# EAGLE design Sensors_Board_V1 (EAGLE 9.6.2)
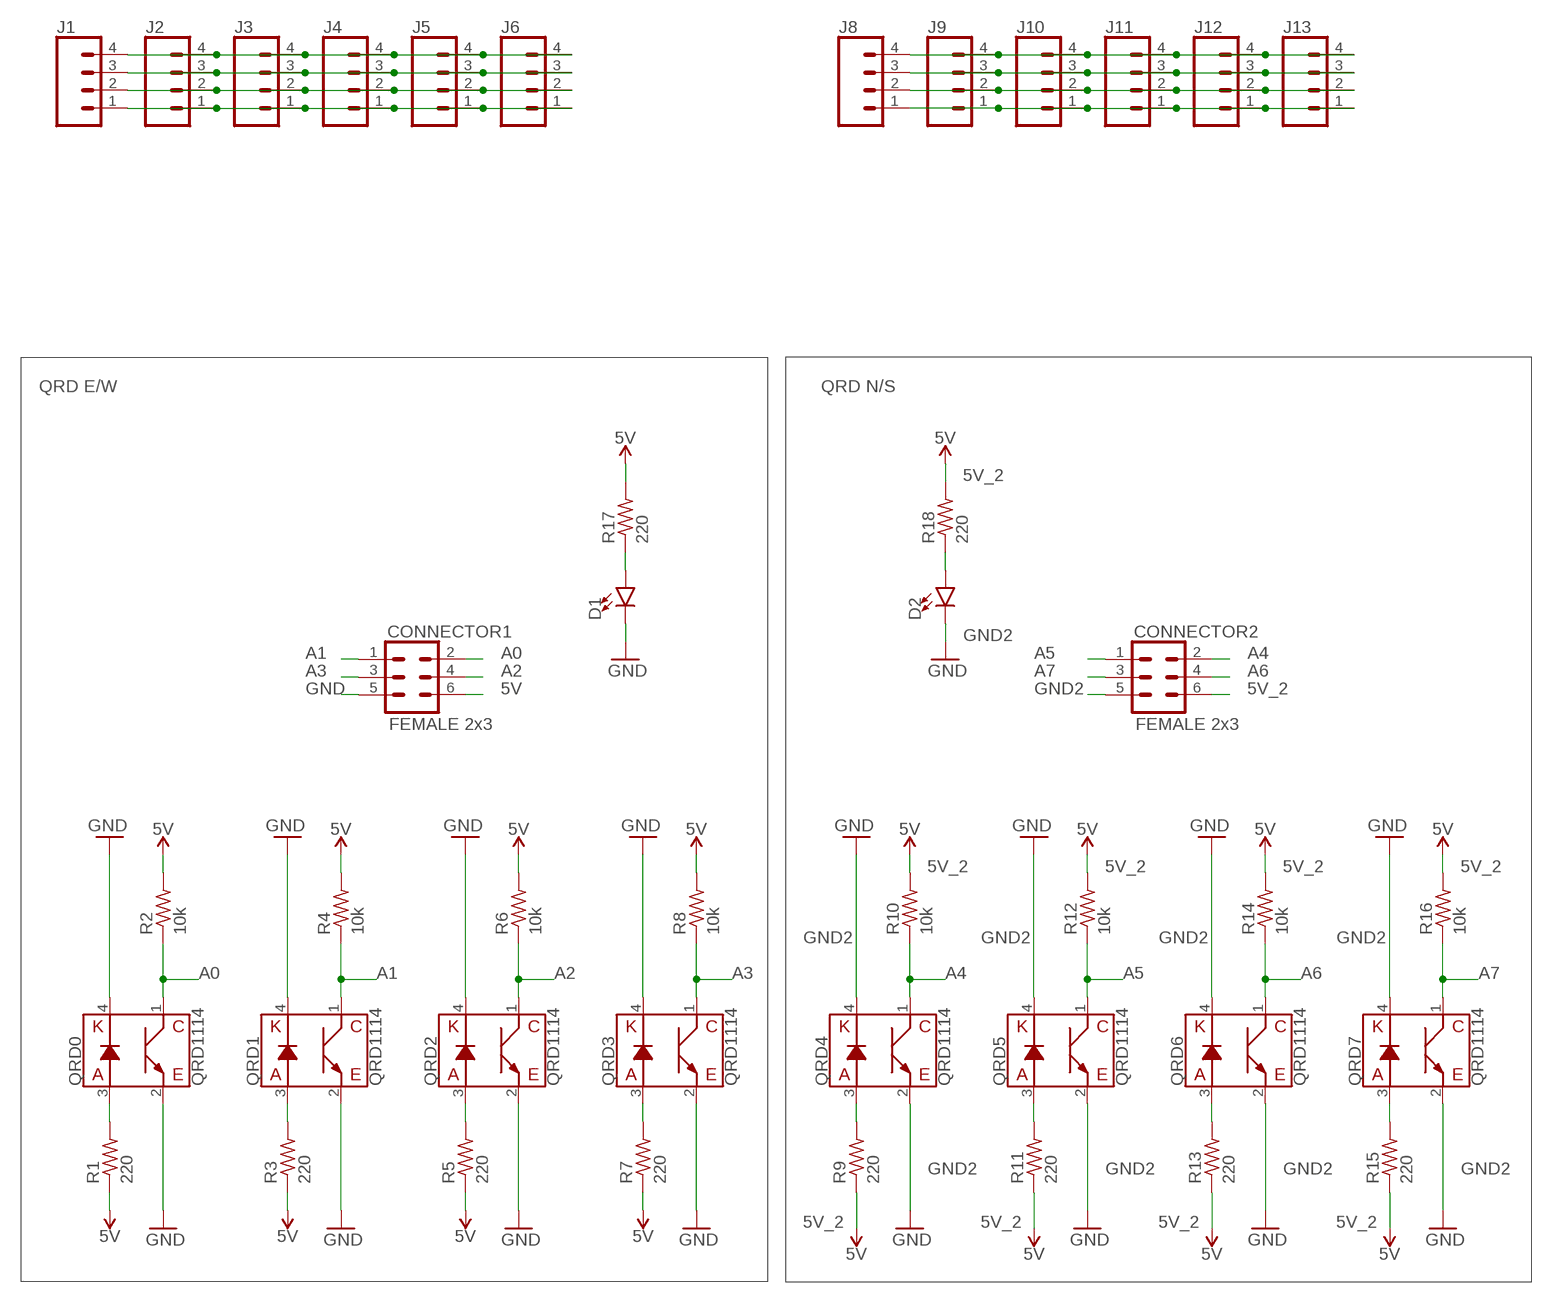
[diagram p0: schematic, sheet 1]

## Parts
CONNECTOR1  FEMALE 2x3  CONN_03X2FEMALE  [2X3]
CONNECTOR2  FEMALE 2x3  CONN_03X2FEMALE  [2X3]
D1  LED3MM  [LED_3MM]
D2  LED3MM  [LED_3MM]
J1  CONN_04  [1X04]
J2  CONN_04  [1X04]
J3  CONN_04  [1X04]
J4  CONN_04  [1X04]
J5  CONN_04  [1X04]
J6  CONN_04  [1X04]
J8  CONN_04  [1X04]
J9  CONN_04  [1X04]
J10  CONN_04  [1X04]
J11  CONN_04  [1X04]
J12  CONN_04  [1X04]
J13  CONN_04  [1X04]
QRD0  QRD1114  [QRD1114]
QRD1  QRD1114  [QRD1114]
QRD2  QRD1114  [QRD1114]
QRD3  QRD1114  [QRD1114]
QRD4  QRD1114  [QRD1114]
QRD5  QRD1114  [QRD1114]
QRD6  QRD1114  [QRD1114]
QRD7  QRD1114  [QRD1114]
R1  220  R-US_0204/7  [0204/7]
R2  10k  R-US_0204/7  [0204/7]
R3  220  R-US_0204/7  [0204/7]
R4  10k  R-US_0204/7  [0204/7]
R5  220  R-US_0204/7  [0204/7]
R6  10k  R-US_0204/7  [0204/7]
R7  220  R-US_0204/7  [0204/7]
R8  10k  R-US_0204/7  [0204/7]
R9  220  R-US_0204/7  [0204/7]
R10  10k  R-US_0204/7  [0204/7]
R11  220  R-US_0204/7  [0204/7]
R12  10k  R-US_0204/7  [0204/7]
R13  220  R-US_0204/7  [0204/7]
R14  10k  R-US_0204/7  [0204/7]
R15  220  R-US_0204/7  [0204/7]
R16  10k  R-US_0204/7  [0204/7]
R17  220  R-US_0204/7  [0204/7]
R18  220  R-US_0204/7  [0204/7]

## Nets
5V: CONNECTOR1.6 R1.1 R2.2 R3.1 R4.2 R5.1 R6.2 R7.1 R8.2 R17.2
5V_2: CONNECTOR2.6 R9.1 R10.2 R11.1 R12.2 R13.1 R14.2 R15.1 R16.2 R18.2 ; supply symbol labelled 5V
A0: CONNECTOR1.2 QRD0.1(C) R2.1
A1: CONNECTOR1.1 QRD1.1(C) R4.1
A2: CONNECTOR1.4 QRD2.1(C) R6.1
A3: CONNECTOR1.3 QRD3.1(C) R8.1
A4: CONNECTOR2.2 QRD4.1(C) R10.1
A5: CONNECTOR2.1 QRD5.1(C) R12.1
A6: CONNECTOR2.4 QRD6.1(C) R14.1
A7: CONNECTOR2.3 QRD7.1(C) R16.1
GND: CONNECTOR1.5 D1.K(C) QRD0.2(E) QRD0.4(K) QRD1.2(E) QRD1.4(K) QRD2.2(E) QRD2.4(K) QRD3.2(E) QRD3.4(K)
GND2: CONNECTOR2.5 D2.K(C) QRD4.2(E) QRD4.4(K) QRD5.2(E) QRD5.4(K) QRD6.2(E) QRD6.4(K) QRD7.2(E) QRD7.4(K) ; supply symbol labelled GND
N$1: QRD0.3(A) R1.2
N$2: QRD1.3(A) R3.2
N$3: QRD2.3(A) R5.2
N$4: QRD3.3(A) R7.2
N$5: QRD4.3(A) R9.2
N$6: QRD5.3(A) R11.2
N$7: QRD6.3(A) R13.2
N$8: QRD7.3(A) R15.2
N$9: D1.A R17.1
N$10: D2.A R18.1
N$11: J1.4 J2.4 J3.4 J4.4 J5.4 J6.4
N$12: J1.3 J2.3 J3.3 J4.3 J5.3 J6.3
N$13: J1.2 J2.2 J3.2 J4.2 J5.2 J6.2
N$14: J1.1 J2.1 J3.1 J4.1 J5.1 J6.1
N$15: J8.4 J9.4 J10.4 J11.4 J12.4 J13.4
N$16: J8.3 J9.3 J10.3 J11.3 J12.3 J13.3
N$17: J8.2 J9.2 J10.2 J11.2 J12.2 J13.2
N$18: J8.1 J9.1 J10.1 J11.1 J12.1 J13.1

## Notes on the sheet
- QRD E/W | QRD N/S

## Library data of the parts
CONNECTOR1 CONNECTOR2 = SparkFun-Connectors:CONN_03X2: Multi connection point. Often used as Generic Header-pin footprint for 0.1 inch spaced/style header connections You can populate with any combo of single row headers, but if you'd like an exact match, check these: Header - 2x3 (Male, 0.1") <https://www.sparkfun.com/products/12807> (PRT-12807) Header - 2x3 (Female, 0.1") <https://www.sparkfun.com/products/13010> (PRT-13010) 2x3 Pin Shrouded Header <https://www.sparkfun.com/products/10877> (PRT-10877) On any of the 0.1 inch spaced packages, you can populate with these: Break Away Headers - Straight <https://www.sparkfun.com/products/116> (PRT-00116) Break Away Male Headers - Right Angle <https://www.sparkfun.com/products/553> (PRT-00553) Female Headers <https://www.sparkfun.com/products/115> (PRT-00115) Break Away Headers - Machine Pin <https://www.sparkfun.com/products/117> (PRT-00117) Break Away Female Headers - Swiss Machine Pin <https://www.sparkfun.com/products/743> (PRT-00743) Special note: the shrouded connector mates well with our 3x2 ribbon cables: Ribbon Crimp Connector - 6-pin (2x3, Female) <https://www.sparkfun.com/products/10651> (PRT-10651) Ribbon Cable - 6 wire (15ft) <https://www.sparkfun.com/products/10646> (PRT-10646); PROD_ID: CONN-11566
D1 D2 = SparkFun-LED:LED: LED (Generic) Standard schematic elements and footprints for 5mm, 3mm, 1206, and 0603 sized LEDs. Generic LEDs with no color specified.; PROD_ID: DIO-08794
J1-J6 J8-J13 = SparkFun-Connectors:CONN_04: Multi connection point. Often used as Generic Header-pin footprint for 0.1 inch spaced/style header connections On any of the 0.1 inch spaced packages, you can populate with these: Break Away Headers - Straight <https://www.sparkfun.com/products/116> (PRT-00116) Break Away Male Headers - Right Angle <https://www.sparkfun.com/products/553> (PRT-00553) Female Headers <https://www.sparkfun.com/products/115> (PRT-00115) Break Away Headers - Machine Pin <https://www.sparkfun.com/products/117> (PRT-00117) Break Away Female Headers - Swiss Machine Pin <https://www.sparkfun.com/products/743> (PRT-00743) For SCREWTERMINALS and SPRING TERMINALS visit here: Screw Terimnals on SparkFun.com <https://www.sparkfun.com/search/results?term=Screw+Terminals> (5mm/3.5mm/2.54mm spacing) This device is also useful as a general connection point to wire up your design to another part of your project. Our various solder wires solder well into these plated through hole pads. Hook-Up Wire - Assortment (Stranded, 22 AWG) <https://www.sparkfun.com/products/11375> (PRT-11375) Hook-Up Wire - Assortment (Solid Core, 22 AWG) <https://www.sparkfun.com/products/11367> (PRT-11367) View the entire wire category on our website here <https://www.sparkfun.com/categories/141> Special notes: Molex polarized connector foot print use with SKU : PRT-08231 with associated crimp pins and housings. 1MM SMD Version SKU: PRT-10208; PROD_ID: CONN-09696
QRD0 QRD1-QRD7 = SparkFun-Sensors:QRD1114: QRD1114 Reflective Proximity, Object Sensor This sensor uses an infrared emitted diode combined with an infrared phototransistor to detect the reflected infrared signal. Ideal for sensing black-to-white transitions or can be used to detect nearby objects (.5-1cm). Datasheet <http://www.sparkfun.com/datasheets/BOT/QRD1114.pdf> SparkFun Products Optical Detector / Phototransistor - QRD1114 <https://www.sparkfun.com/products/246> (SEN-00246); PROD_ID: IC-09032; SF_ID: SEN-00246
R1-R18 = adafruit:R-US_: RESISTOR, American symbol

## Board
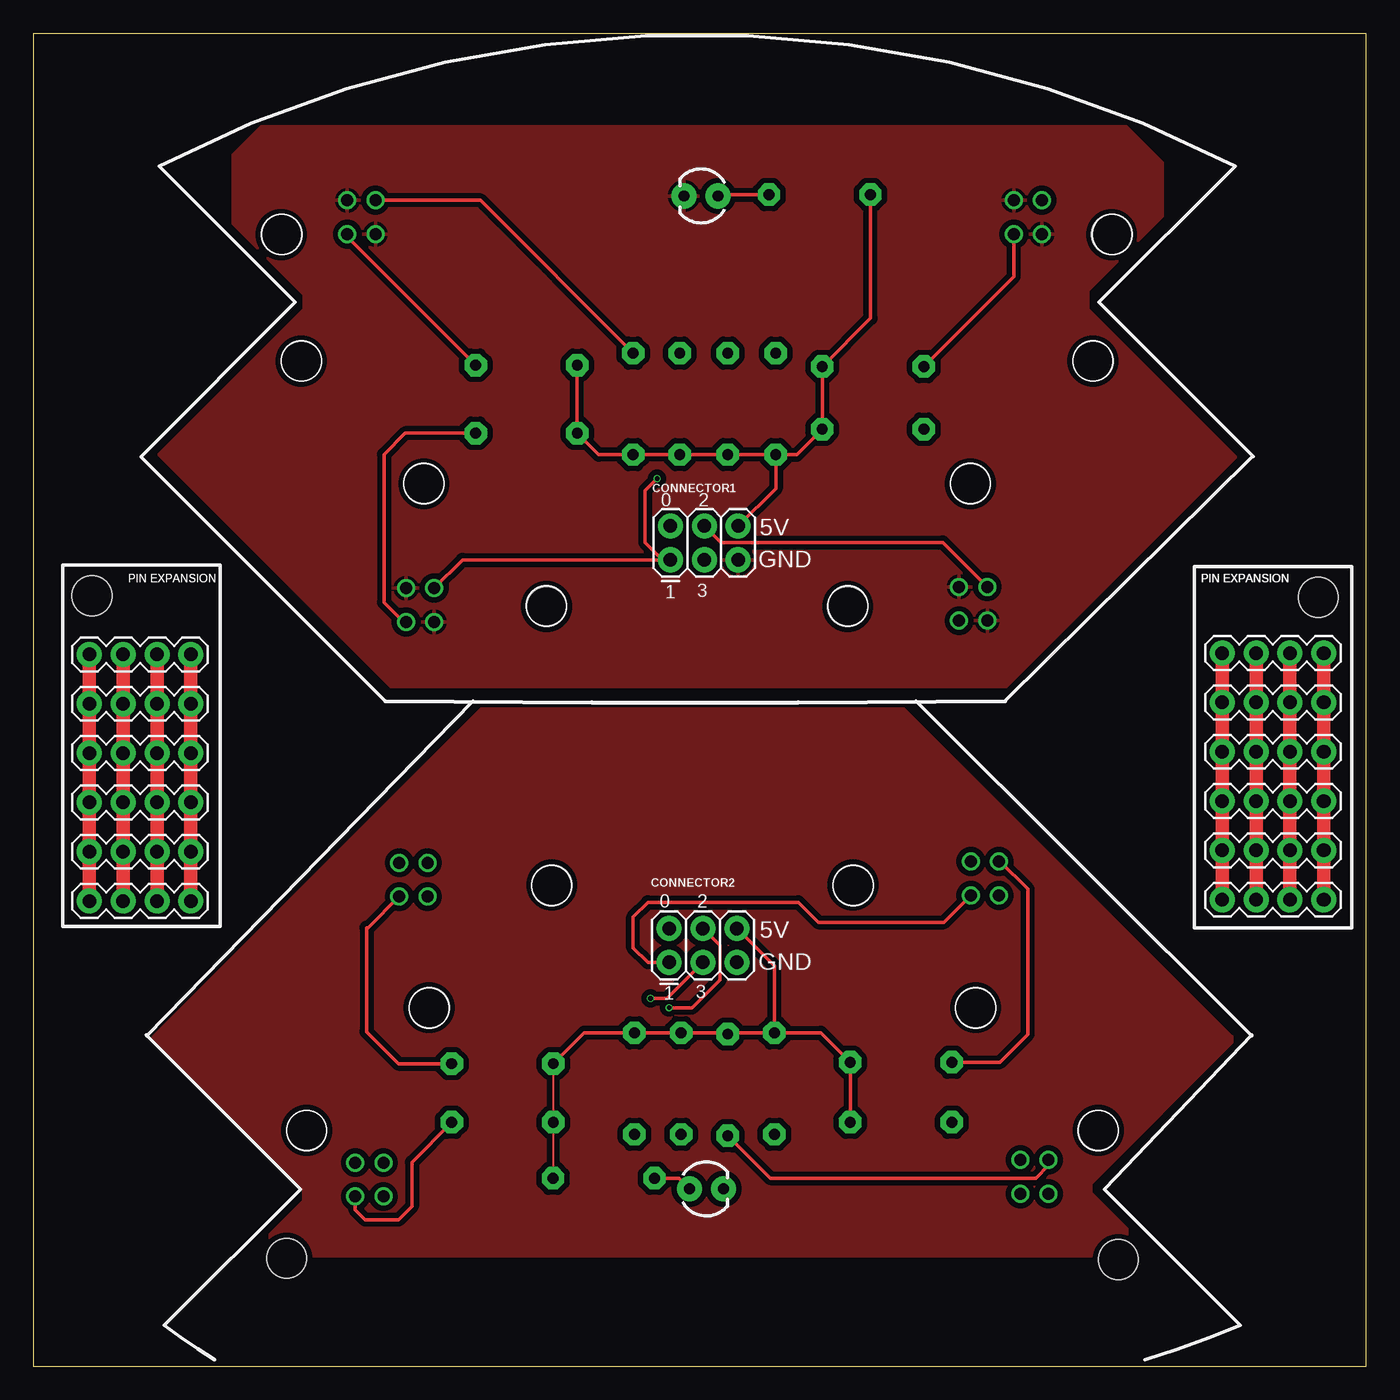
[diagram p1: board, top side]
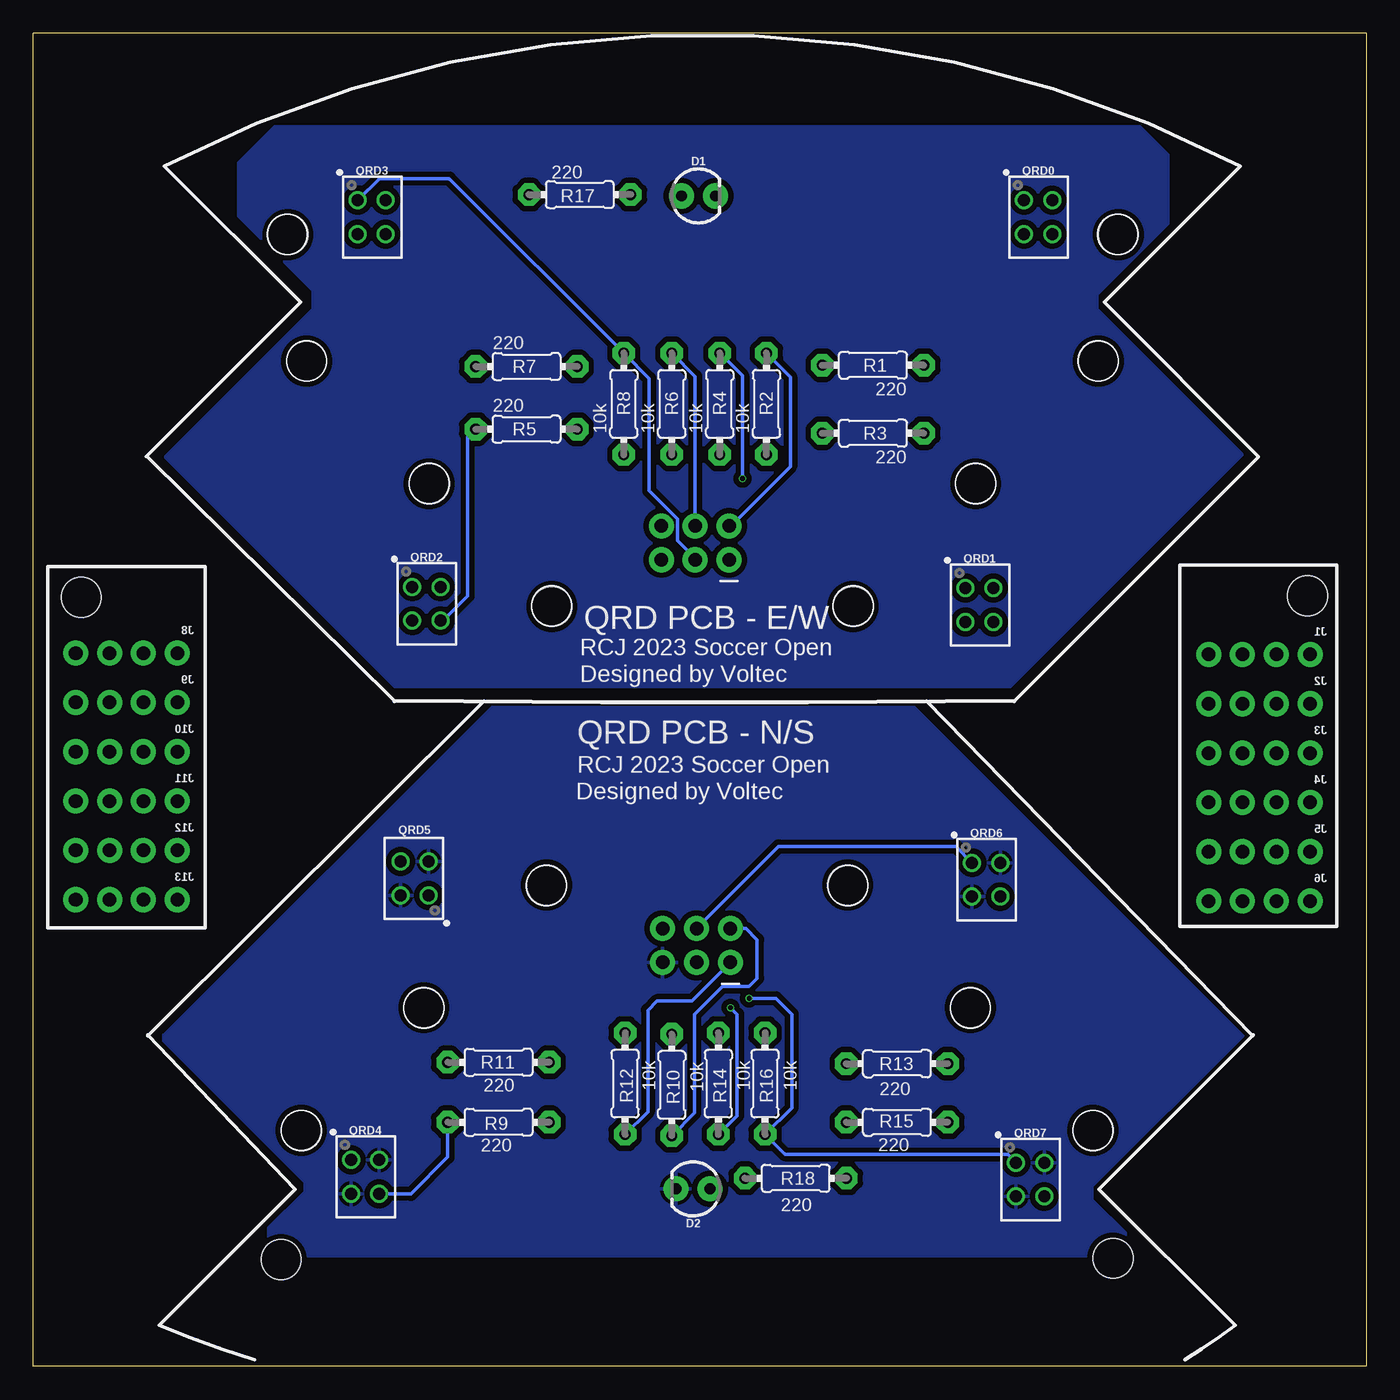
[diagram p2: board, bottom side, seen from below]

Size 100 x 100 mm. Coordinates in mm from the lower left corner, seen from the top.
Outline: 0,0 100,0 100,100 0,100 0,0
Copper layers (1*16): Top 0.035559375mm / dielectric 1.6mm / Bottom 0.035559375mm
Design rules "jlcpcb2layer": minimum track width 5mil, minimum drill 12mil, track to track 5mil, track to pad 5mil, pad to pad 5mil, via to via 5mil, smd to smd 5mil, copper to edge 8mil, drill to drill 6mil, minimum pad ring 5mil, minimum via ring 3mil, stop-mask expansion 2.5mil, vias tented up to drill 0mil, thermal gap 10mil
Holes 3 mm at 29.7,26.9 20.5,17.7 38.9,36.1 61.5,36.1 70.7,26.9 79.9,17.7 79.5,75.4 81.4,8 19,8.1 80.9,84.9 70.3,66.2 61.1,57 38.5,57 29.3,66.2 20.1,75.4 18.6,84.9 4.4,57.8 96.4,57.7

### Footprints (pad centres in the part's own frame; a part is rotated, then mirrored left to right if it is on the bottom)
2X3 = drill 1.016 pad 1.88: 1 0,0; 2 0,2.54; 3 2.54,0; 4 2.54,2.54; 5 5.08,0; 6 5.08,2.54
LED_3MM = drill 0.813 pad 1.88: A -1.27,0; K 1.27,0
1X04 = drill 1.016 pad 1.88: 1 0,0; 2 2.54,0; 3 5.08,0; 4 7.62,0
QRD1114 = drill 0.9: 1 -1.067,1.27; 2 -1.067,-1.27; 3 1.041,-1.27; 4 1.041,1.27
0204/7 = drill 0.813 pad 1.676 octagon: 1 -3.81,0; 2 3.81,0

### Placement (x,y rotation side)
CONNECTOR1  47.8,60.5 0 top
CONNECTOR2  47.7,30.3 0 top
D1  50.1,87.8 0 bottom
D2  50.5,13.3 180 bottom
J1  4.2,53.4 0 top
J2  4.2,49.7 0 top
J3  4.2,46 0 top
J4  4.2,42.3 0 top
J5  4.2,38.6 0 top
J6  4.2,34.9 0 top
J8  89.2,53.5 0 top
J9  89.2,49.8 0 top
J10  89.2,46.1 0 top
J11  89.2,42.4 0 top
J12  89.2,38.7 0 top
J13  89.2,35 0 top
QRD0  24.6,86.2 0 bottom
QRD1  29,57.1 0 bottom
QRD2  70.5,57.2 0 bottom
QRD3  74.6,86.2 0 bottom
QRD4  75.1,14.2 0 bottom
QRD5  71.4,36.6 180 bottom
QRD6  28.5,36.5 0 bottom
QRD7  25.2,14 0 bottom
R1  37,75.1 0 bottom
R2  45,72.2 270 bottom
R3  37,70 0 bottom
R4  48.5,72.2 270 bottom
R5  63,70.3 180 bottom
R6  52.1,72.2 270 bottom
R7  63,75 180 bottom
R8  55.7,72.2 270 bottom
R9  65.1,18.3 180 bottom
R10  52.1,21.1 90 bottom
R11  65.1,22.8 180 bottom
R12  55.6,21.2 90 bottom
R13  35.2,22.7 0 bottom
R14  48.6,21.2 90 bottom
R15  35.2,18.3 0 bottom
R16  45.1,21.2 90 bottom
R17  59,87.9 180 bottom
R18  42.8,14.1 0 bottom

### Tracks (layer width: path | path; a pad name or v marks a point on that pad's centre or on a via)
5V
  Top 0.254: R8.2 55.7,65.86 CONNECTOR1.6 | R8.2 R6.2 R4.2 R2.2 42.42,68.39 R3.1 R1.1 | R8.2 57.28,68.39 R5.1 R7.1 62.81,78.62 R17.2
5V_2
  Top 0.152: R13.1 R15.1 39.01,14.12
  Top 0.254: R12.2 52.2,25.01 R10.2 52,25.01 R14.2 R16.2 41.32,25.01 R13.1 | R12.2 55.6,30.02 CONNECTOR2.6 | 39.01,14.12 R18.2 | R12.2 59.08,25.01 R11.1 R9.1
A0
  Top 0.254: R2.1 33.54,87.47 QRD0.1
  Bottom 0.254: R2.1 43.2,74.21 43.2,67.5 47.66,63.04 CONNECTOR1.2
A1  (via drill 0.35)
  Top 0.254: QRD1.1 32.2,60.5 47.2,60.5 | CONNECTOR1.1 47.3,60.5 47.2,60.5 | v46.8,66.6 45.9,65.7 45.9,61.8 47.2,60.5
  Bottom 0.254: R4.1 46.8,74.31 v46.8,66.6
A2
  Top 0.254: CONNECTOR1.4 51.58,61.8 68.24,61.8 QRD2.1
  Bottom 0.254: R6.1 50.34,74.25 CONNECTOR1.4
A3
  Bottom 0.254: CONNECTOR1.3 50.34,60.64 51.66,61.96 51.66,63.55 53.8,65.68 53.8,74.11 R8.1 68.79,89.1 74.04,89.1 QRD3.1
A4
  Top 0.254: R10.1 55.29,14.1 75.2,14.1 76.17,15.07 QRD4.1
  Bottom 0.254: R10.1 50.4,18.99 50.4,26.4 48.3,28.5 46.3,28.5 45.7,29.1 45.7,32 46.54,32.84 CONNECTOR2.2
A5
  Top 0.254: CONNECTOR2.1 46.1,30.3 45,31.4 45,33.7 46.1,34.8 57.4,34.8 58.9,33.3 68.3,33.3 QRD5.1
  Bottom 0.254: CONNECTOR2.1 50.6,27.4 53.2,27.4 53.9,26.7 53.9,19.09 R12.1
A6  (via drill 0.35)
  Top 0.254: CONNECTOR2.4 51.5,31.58 51.5,29 49.4,26.9 v47.7,26.9
  Bottom 0.254: v47.7,26.9 47.2,26.4 47.2,18.79 R14.1 | CONNECTOR2.4 44.08,39 30.8,39 QRD6.1
A7  (via drill 0.35)
  Top 0.254: v46.3,27.6 47.54,27.6 CONNECTOR2.3
  Bottom 0.254: QRD7.1 26.9,15.9 43.61,15.9 R16.1 43.1,19.39 43.1,26.4 44.3,27.6 v46.3,27.6
GND
  pour Top (isolate 0.406): 26.8,51 73,51 90.2,68.2 79.1,79.3 79.1,80.7 84.7,86.3 84.7,90.3 82,93 17.1,93 15,90.9 15,85.7 20.3,80.4 20.3,79.3 9.4,68.4
GND1
  pour Top (isolate 0.406): 33.6,49.4 65.3,49.4 89.9,24.8 90,24.8 90,24.3 79.4,13.7 79.4,13 82.1,10.3 82.1,8.2 17.7,8.2 17.7,9.9 20.2,12.4 20.2,13.4 8.9,24.7
GND2
  pour Bottom (isolate 0.406): 33.9,49.5 65.6,49.5 90.2,24.9 90.3,24.9 90.3,24.4 79.7,13.8 79.7,13.1 82.4,10.4 82.4,8.2 18,8.2 18,10 20.5,12.5 20.5,13.5 9.2,24.8
GND3
  pour Bottom (isolate 0.406): 26.7,51 72.9,51 90.1,68.2 79,79.3 79,80.7 84.6,86.3 84.6,90.3 81.9,93 17,93 14.9,90.9 14.9,85.7 20.2,80.4 20.2,79.3 9.3,68.4
N$1
  Top 0.254: QRD0.3 23.56,84.73 R1.2
N$2
  Top 0.254: R3.2 27.9,70 26.3,68.4 26.3,57.3 27.77,55.83 QRD1.3
N$3
  Bottom 0.254: R5.2 67.4,69.71 67.4,57.8 69.27,55.93 QRD2.3
N$4
  Top 0.254: R7.2 73.56,81.75 QRD3.3
N$5
  Bottom 0.254: R9.2 68.91,15.69 71.67,12.93 QRD4.3
N$6
  Top 0.254: R11.2 72.5,22.8 74.6,24.9 74.6,35.8 72.53,37.87 QRD5.3
N$7
  Top 0.254: QRD6.3 25.13,32.9 25,32.9 25,25.1 27.4,22.7 R13.2
N$8
  Top 0.254: R15.2 28.4,15.31 28.4,12 27.4,11 24.9,11 24.16,11.74 QRD7.3
N$9
  Top 0.254: D1.A 51.47,87.9 R17.1
N$10
  Top 0.254: R18.1 48.43,14.1 D2.A
N$11
  Top 1.016: J1.4 J2.4 J3.4 J4.4 J5.4 J6.4
N$12
  Top 1.016: J6.3 J5.3 J4.3 J3.3 J2.3 J1.3
N$13
  Top 1.016: J6.2 J5.2 J4.2 J3.2 J2.2 J1.2
N$14
  Top 1.016: J6.1 J5.1 J4.1 J3.1 J2.1 J1.1
N$15
  Top 1.016: J8.4 J9.4 J10.4 J11.4 J12.4 J13.4
N$16
  Top 1.016: J13.3 J12.3 J11.3 J10.3 J9.3 J8.3
N$17
  Top 1.016: J8.2 J9.2 J10.2 J11.2 J12.2 J13.2
N$18
  Top 1.016: J13.1 J12.1 J11.1 J10.1 J9.1 J8.1

### Text on the board
tNames: 0 | 2 | 5V | GND | PIN EXPANSION | PIN EXPANSION | PIN EXPANSION | PIN EXPANSION | PIN EXPANSION | PIN EXPANSION | PIN EXPANSION | PIN EXPANSION | 1 | 3 | 0 | 2 | 5V | GND | 1 | 3
bNames: QRD PCB - E/W | RCJ 2023 Soccer Open | Designed by Voltec | QRD PCB - N/S | RCJ 2023 Soccer Open | Designed by Voltec